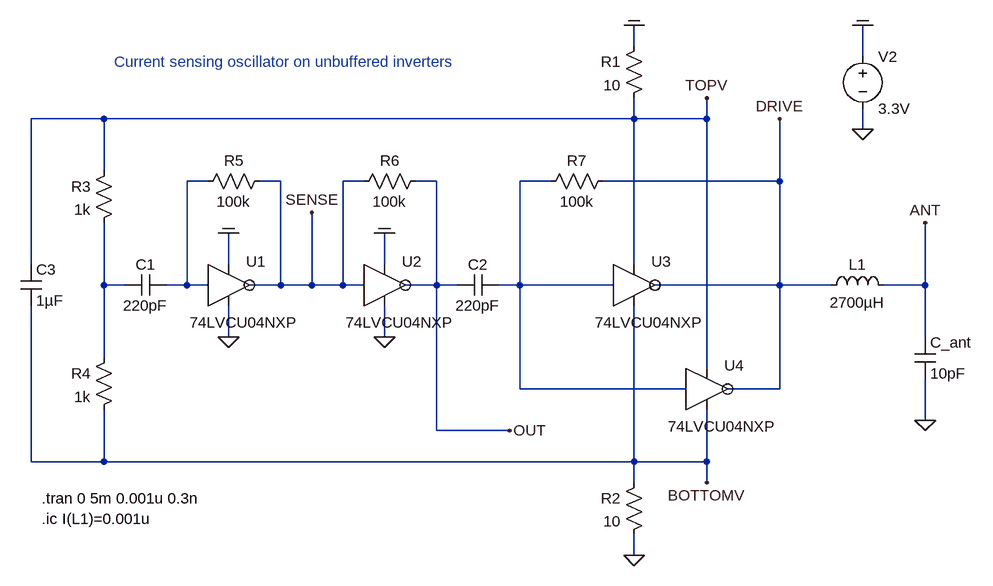
[diagram p0: schematic 2021_current_sensing_unbuffered_inverters_05.asc]
2021_current_sensing_unbuffered_inverters_05.asc, the LTspice schematic file:
Version 4
SHEET 1 13280 8692
WIRE 3296 5392 3296 5360
WIRE 3648 5408 3648 5360
WIRE 2480 5504 2368 5504
WIRE 3296 5504 3296 5472
WIRE 3296 5504 2480 5504
WIRE 3408 5504 3408 5472
WIRE 3408 5504 3296 5504
WIRE 3648 5520 3648 5488
WIRE 2480 5584 2480 5504
WIRE 2640 5600 2608 5600
WIRE 2752 5600 2720 5600
WIRE 2880 5600 2848 5600
WIRE 2992 5600 2960 5600
WIRE 3168 5600 3120 5600
WIRE 3520 5600 3520 5504
WIRE 3520 5600 3248 5600
WIRE 2368 5728 2368 5504
WIRE 2672 5728 2672 5680
WIRE 2912 5728 2912 5680
WIRE 3296 5728 3296 5504
WIRE 2480 5760 2480 5664
WIRE 2512 5760 2480 5760
WIRE 2608 5760 2608 5600
WIRE 2608 5760 2576 5760
WIRE 2640 5760 2608 5760
WIRE 2752 5760 2752 5600
WIRE 2752 5760 2704 5760
WIRE 2800 5760 2800 5648
WIRE 2800 5760 2752 5760
WIRE 2848 5760 2848 5600
WIRE 2848 5760 2800 5760
WIRE 2880 5760 2848 5760
WIRE 2992 5760 2992 5600
WIRE 2992 5760 2944 5760
WIRE 3024 5760 2992 5760
WIRE 3120 5760 3120 5600
WIRE 3120 5760 3088 5760
WIRE 3264 5760 3120 5760
WIRE 3520 5760 3520 5600
WIRE 3520 5760 3328 5760
WIRE 3600 5760 3520 5760
WIRE 3744 5760 3744 5664
WIRE 3744 5760 3680 5760
WIRE 2672 5840 2672 5792
WIRE 2912 5840 2912 5792
WIRE 3744 5840 3744 5760
WIRE 2480 5872 2480 5760
WIRE 3408 5888 3408 5504
WIRE 3120 5920 3120 5760
WIRE 3376 5920 3120 5920
WIRE 3520 5920 3520 5760
WIRE 3520 5920 3440 5920
WIRE 3744 5968 3744 5904
WIRE 2992 5984 2992 5760
WIRE 3104 5984 2992 5984
WIRE 2368 6032 2368 5792
WIRE 2480 6032 2480 5952
WIRE 2480 6032 2368 6032
WIRE 3296 6032 3296 5792
WIRE 3296 6032 2480 6032
WIRE 3408 6032 3408 5952
WIRE 3408 6032 3296 6032
WIRE 3296 6064 3296 6032
WIRE 3408 6064 3408 6032
WIRE 3296 6176 3296 6144
FLAG 3648 5520 0
FLAG 3648 5360 COM
FLAG 3744 5968 0
FLAG 3744 5664 ANT
FLAG 3520 5504 DRIVE
FLAG 3296 5360 COM
FLAG 3296 6176 0
FLAG 2912 5680 COM
FLAG 2912 5840 0
FLAG 2672 5680 COM
FLAG 2672 5840 0
FLAG 2800 5648 SENSE
FLAG 3104 5984 OUT
FLAG 3408 5472 TOPV
FLAG 3408 6064 BOTTOMV
SYMBOL voltage 3648 5392 R0
WINDOW 123 0 0 Left 2
WINDOW 39 0 0 Left 2
SYMATTR InstName V2
SYMATTR Value 3.3V
SYMBOL 74LVCU04NXP 3296 5760 R0
SYMATTR InstName U3
SYMBOL ind 3584 5776 R270
WINDOW 0 32 56 VTop 2
WINDOW 3 5 56 VBottom 2
SYMATTR InstName L1
SYMATTR Value 2700µH
SYMATTR SpiceLine Rser=120 Cpar=1.2pF
SYMBOL cap 3728 5840 R0
SYMATTR InstName C_ant
SYMATTR Value 10pF
SYMBOL res 3312 5376 M0
WINDOW 0 36 40 Left 2
WINDOW 3 36 76 Left 2
SYMATTR InstName R1
SYMATTR Value 10
SYMBOL res 3312 6048 M0
WINDOW 0 36 40 Left 2
WINDOW 3 36 76 Left 2
SYMATTR InstName R2
SYMATTR Value 10
SYMBOL res 3264 5584 R90
WINDOW 0 0 56 VBottom 2
WINDOW 3 32 56 VTop 2
SYMATTR InstName R7
SYMATTR Value 100k
SYMBOL cap 3088 5744 R90
WINDOW 0 0 32 VBottom 2
WINDOW 3 32 32 VTop 2
SYMATTR InstName C2
SYMATTR Value 220pF
SYMBOL res 2496 5856 M0
WINDOW 0 36 40 Left 2
WINDOW 3 36 76 Left 2
SYMATTR InstName R4
SYMATTR Value 1k
SYMBOL res 2496 5568 M0
WINDOW 0 36 40 Left 2
WINDOW 3 36 76 Left 2
SYMATTR InstName R3
SYMATTR Value 1k
SYMBOL 74LVCU04NXP 2912 5760 R0
SYMATTR InstName U2
SYMBOL cap 2576 5744 R90
WINDOW 0 0 32 VBottom 2
WINDOW 3 32 32 VTop 2
SYMATTR InstName C1
SYMATTR Value 220pF
SYMBOL res 2976 5584 R90
WINDOW 0 0 56 VBottom 2
WINDOW 3 32 56 VTop 2
SYMATTR InstName R6
SYMATTR Value 100k
SYMBOL 74LVCU04NXP 2672 5760 R0
SYMATTR InstName U1
SYMBOL res 2736 5584 R90
WINDOW 0 0 56 VBottom 2
WINDOW 3 32 56 VTop 2
SYMATTR InstName R5
SYMATTR Value 100k
SYMBOL cap 2352 5728 R0
SYMATTR InstName C3
SYMATTR Value 1µF
SYMBOL 74LVCU04NXP 3408 5920 R0
SYMATTR InstName U4
TEXT 2384 6088 Left 2 !.tran 0 5m 0.001u 0.3n
TEXT 2496 5416 Left 2 ;Current sensing oscillator on unbuffered inverters
TEXT 2384 6120 Left 2 !.ic I(L1)=0.001u

The netlist it stands for:
* 2021_current_sensing_unbuffered_inverters_05.asc
V2 COM 0 3.3V
XU3 N002 DRIVE TOPV BOTTOMV 74LVCU04NXP  ; pins A Y VCC AGND
L1 DRIVE ANT 2700µH Rser=120 Cpar=1.2pF
C_ant ANT 0 10pF
R1 COM TOPV 10
R2 BOTTOMV 0 10
R7 DRIVE N002 100k
C2 N002 OUT 220pF
R4 N003 BOTTOMV 1k
R3 TOPV N003 1k
XU2 SENSE OUT COM 0 74LVCU04NXP  ; pins A Y VCC AGND
C1 N001 N003 220pF
R6 OUT SENSE 100k
XU1 N001 SENSE COM 0 74LVCU04NXP  ; pins A Y VCC AGND
R5 SENSE N001 100k
C3 TOPV BOTTOMV 1µF
XU4 N002 DRIVE TOPV BOTTOMV 74LVCU04NXP  ; pins A Y VCC AGND
.tran 0 5m 0.001u 0.3n
* Current sensing oscillator on unbuffered inverters
.ic I(L1)=0.001u
.lib 74LVCU04NXP.cir
.backanno
.end